# EasyEDA schematic EasyEDA Schematics.json
TITLE: LEDs; REV: 1.0; Date: 2019-06-13; Sheet: 1/1; Drawn By: Gabriel Barbosa; Company: PTR - UnB
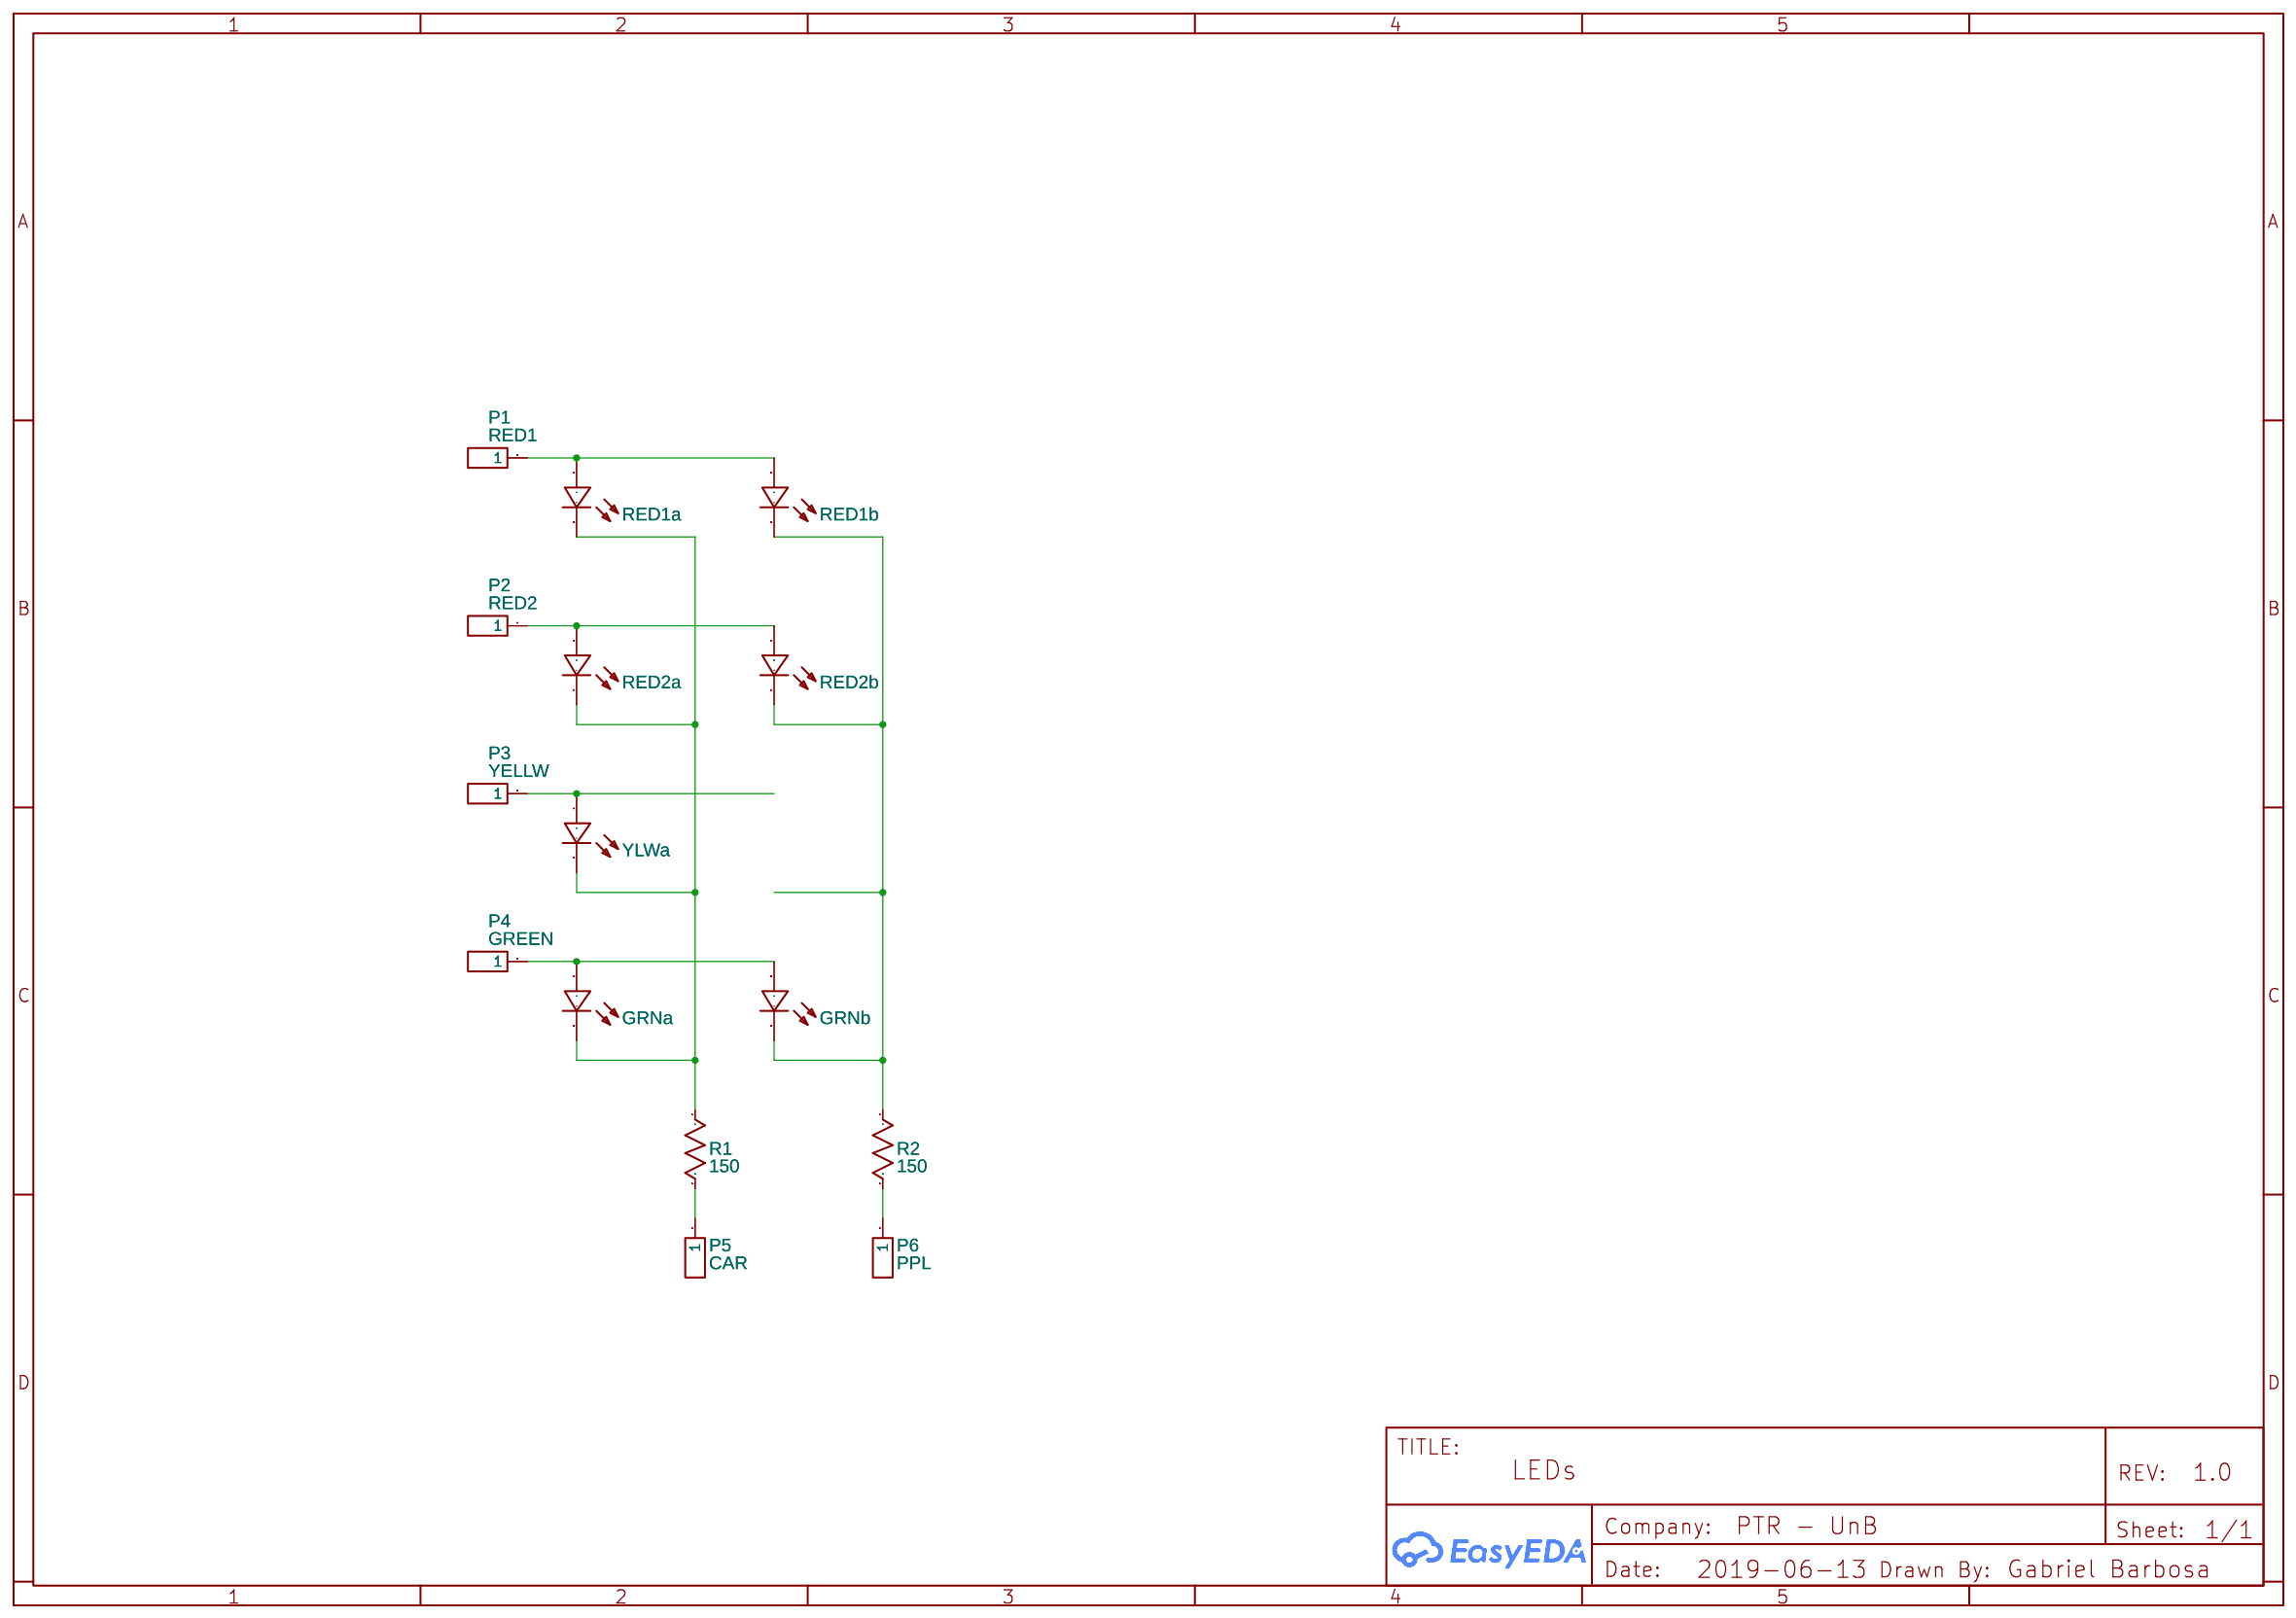
[diagram p0: schematic sheet]

## Parts
LED1  RED1a  [LED-3MM/2.54]
LED2  RED1b  [LED-3MM/2.54]
LED3  RED2a  [LED-3MM/2.54]
LED4  RED2b  [LED-3MM/2.54]
LED5  YLWa  [LED-3MM/2.54]
LED7  GRNa  [LED-3MM/2.54]
LED8  GRNb  [LED-3MM/2.54]
P1  RED1  [HDR-1X1/2.54]
P2  RED2  [HDR-1X1/2.54]
P3  YELLW  [HDR-1X1/2.54]
P4  GREEN  [HDR-1X1/2.54]
P5  CAR  [HDR-1X1/2.54]
P6  PPL  [HDR-1X1/2.54]
R1  150  [AXIAL-0.3]
R2  150  [AXIAL-0.3]

## Library data of the parts
LED1-LED5 LED7 LED8 = -: Supplier: LCSC; Manufacturer: EVERLIGHT; Manufacturer Part: 204-10SURD/S530-A3; Supplier Part: C99772; Package Display: No
P1-P6 = -: Supplier: LCSC; Manufacturer: ReliaPro; Manufacturer Part: Header-Male-2.54_1x1; Supplier Part: C81276
R1 R2 = Res_AXIAL-0.3(1/8W)_US: Manufacturer Part: ?

## Nets
Net-(LED1-1): LED1.1(+) LED2.1(+) P1.1
Net-(LED1-2): LED1.2(-) LED3.2(-) LED5.2(-) LED7.2(-) R1.1
Net-(LED2-2): LED2.2(-) LED4.2(-) LED8.2(-) R2.1
Net-(LED3-1): LED3.1(+) LED4.1(+) P2.1
Net-(LED5-1): LED5.1(+) P3.1
Net-(LED7-1): LED7.1(+) LED8.1(+) P4.1
Net-(P5-1): P5.1 R1.2
Net-(P6-1): P6.1 R2.2
